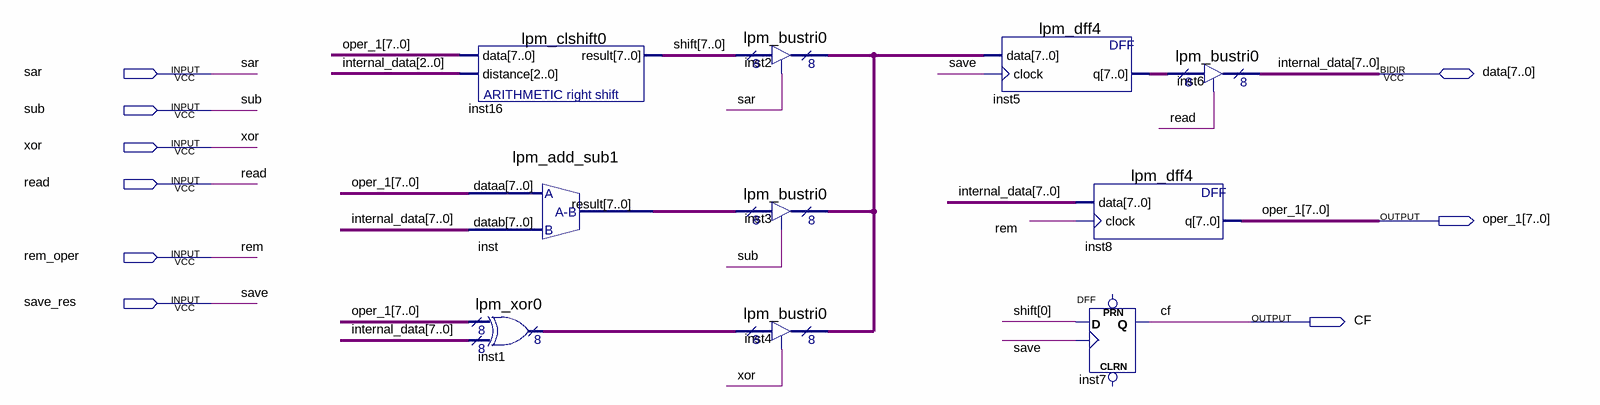
[diagram p0: schematic sheet]
// Quartus schematic alu.bdf as structural Verilog: 10 symbols, 9 pins
module alu (
  input  sar,
  input  sub,
  input  \xor ,
  input  read,
  input  rem_oper,
  input  save_res,
  inout  [7:0] data,
  output [7:0] oper_1,
  output CF
);

  wire [7:0] inst1_result, inst2_tridata, inst5_q, inst_result, shift;

  lpm_clshift0 inst16 (.data(oper_1), .distance(data[2:0]), .result(shift));
  lpm_add_sub1 inst (.dataa(oper_1), .datab(data), .result(inst_result));
  lpm_xor0 inst1 (.data0x(oper_1), .data1x(data), .result(inst1_result));
  lpm_bustri0 inst2 (.enabledt(sar), .data(shift), .tridata(inst2_tridata));
  lpm_bustri0 inst3 (.enabledt(sub), .data(inst_result), .tridata(inst2_tridata));
  lpm_bustri0 inst4 (.enabledt(\xor ), .data(inst1_result), .tridata(inst2_tridata));
  lpm_dff4 inst5 (.data(inst2_tridata), .clock(save_res), .q(inst5_q));
  lpm_dff4 inst8 (.data(data), .clock(rem_oper), .q(oper_1));
  DFF inst7 (.CLK(save_res), .D(shift[0]), .Q(CF));  // open: CLRN, PRN
  lpm_bustri0 inst6 (.enabledt(read), .data(inst5_q), .tridata(data));

  // Other names for the same wires on the sheet: internal_data[7:0] = data; rem = rem_oper; save = save_res
endmodule
